# EasyEDA Pro project ProPrj_103-HQU15集成板-Vel3.1.epro, board PCB1
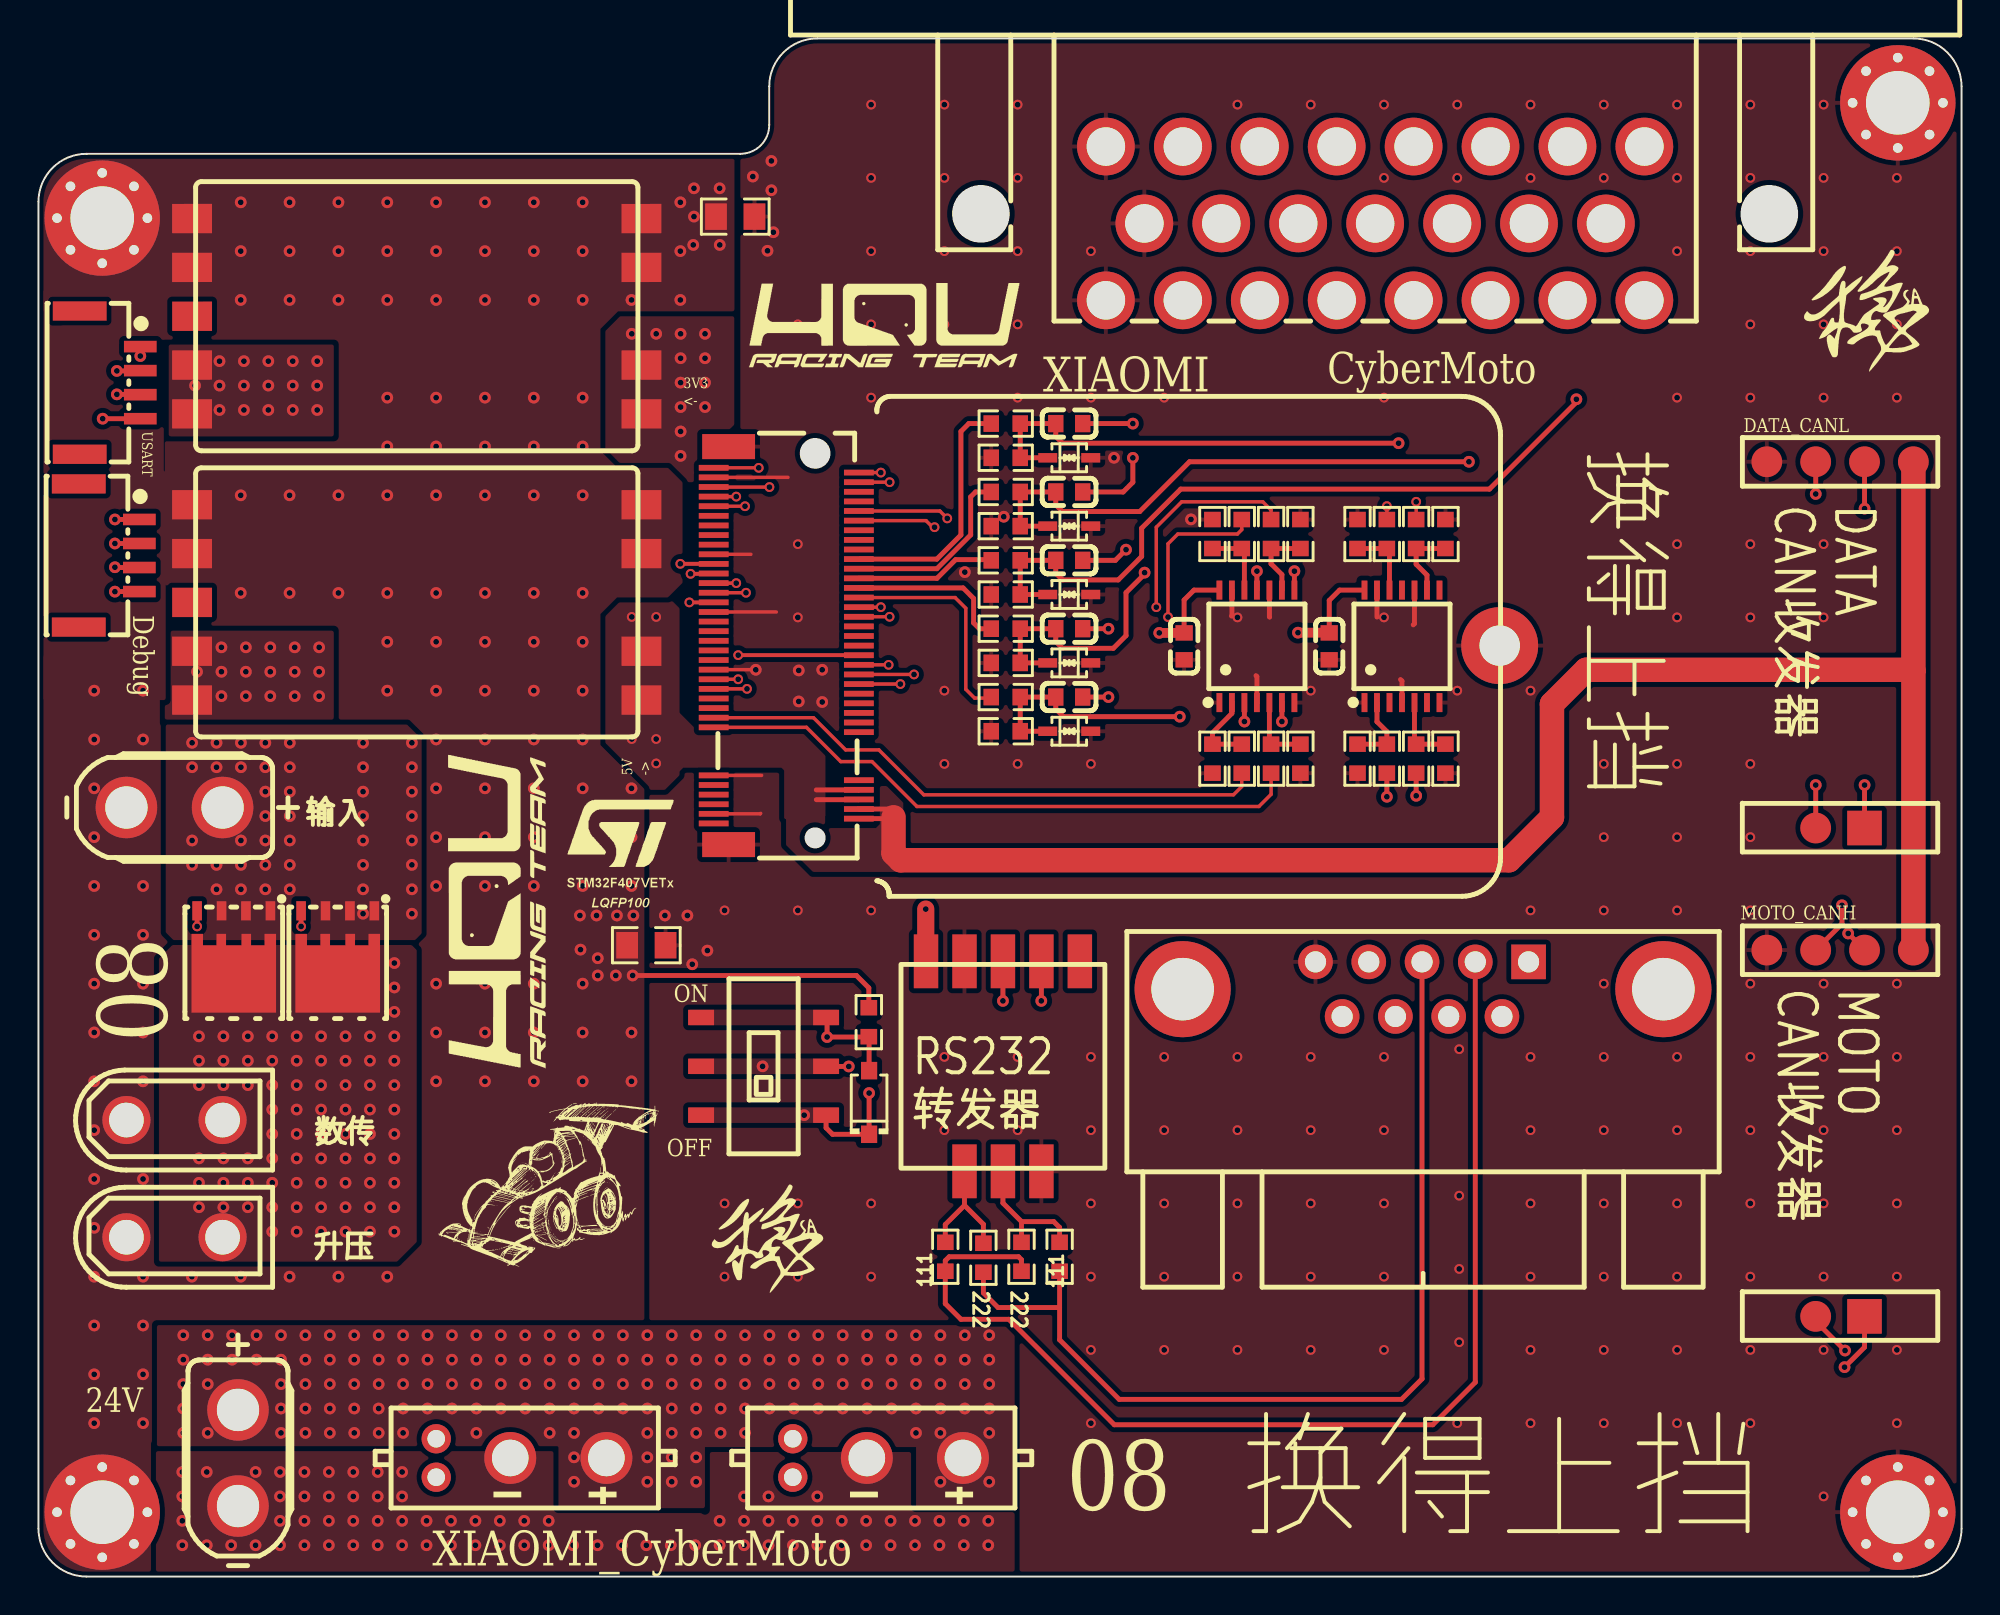
[diagram p5: board, top side]
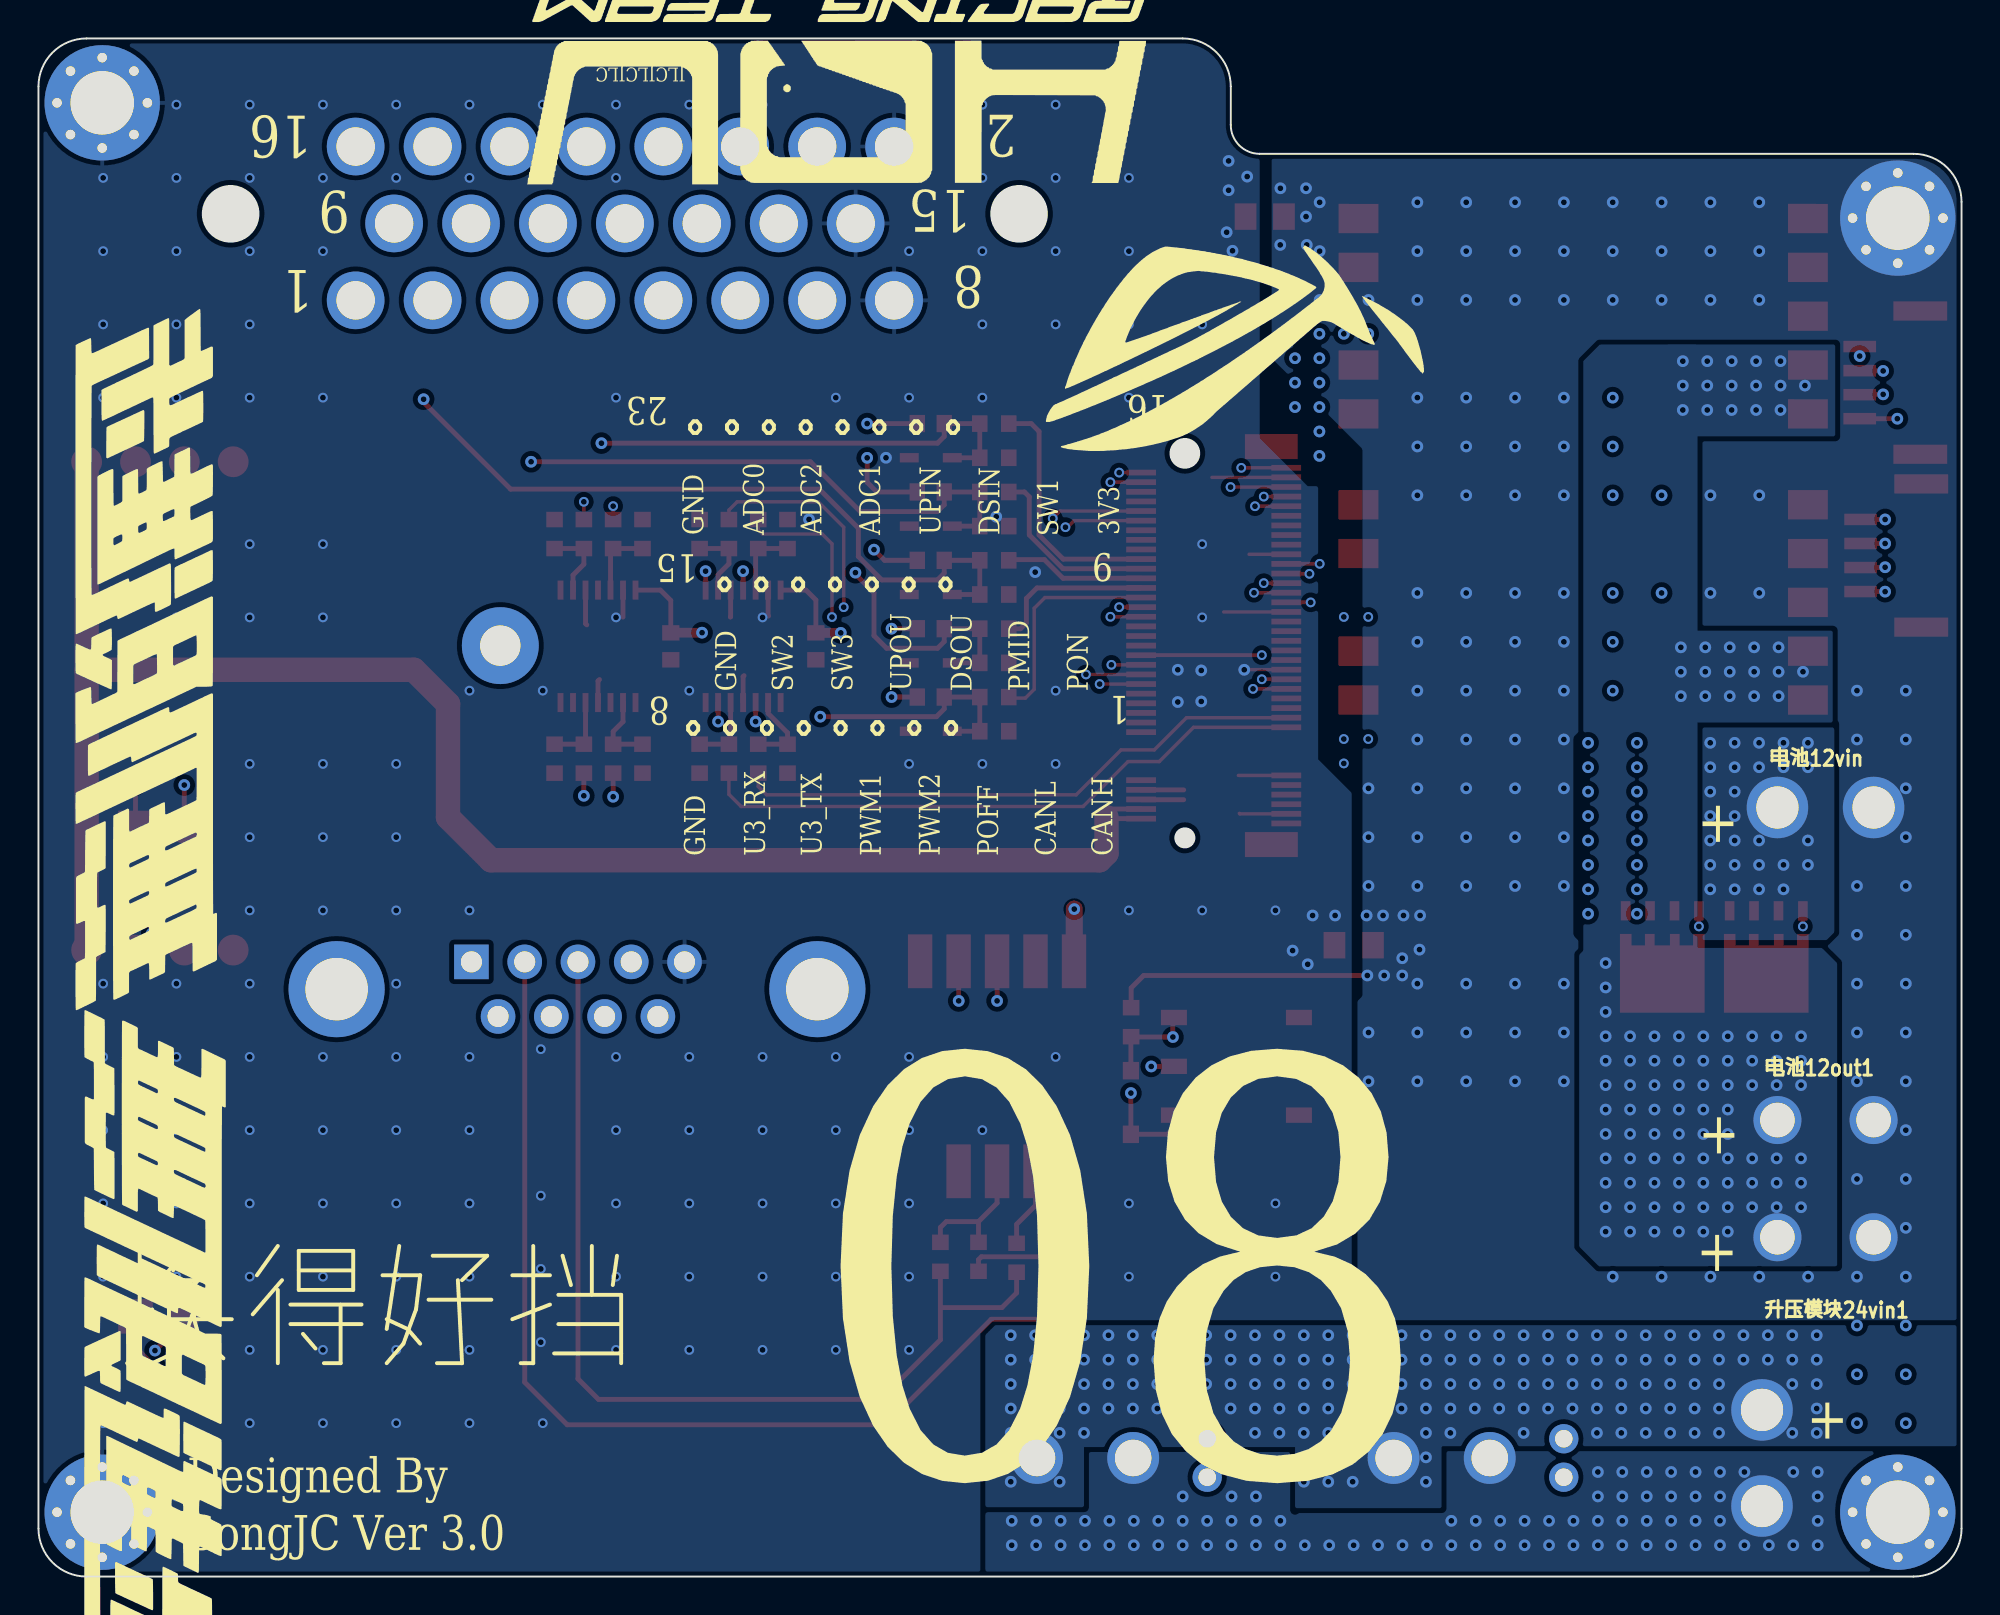
[diagram p6: board, bottom side, seen from below]

Outline 100 x 80 mm; copper layers: Top Layer, Inner1, Inner2, Bottom Layer. Coordinates in mm from the lower left corner of the outline.
Outline path: 0,71.5 arc(0.73,73.27) 2.5,74 36.5,74 arc(37.56,74.44) 38,75.5 38,77.5 arc(38.73,79.27) 40.5,80 97.5,80 arc(99.27,79.27) 100,77.5 100,2.5 arc(99.27,0.73) 97.5,0 2.5,0 arc(0.73,0.73) 0,2.5 0,71.5
Stack: Top Layer 0.035mm 外层铜厚1oz / Dielectric1 0.2104mm 7628 RC49% 8.6mil / Inner1 0.0152mm 内层铜厚 / Dielectric2 1.065mm 1.1mm H/HOZ Copper / Inner2 0.0152mm 内层铜厚 / Dielectric3 0.2104mm 7628 RC49% 8.6mil / Bottom Layer 0.035mm 外层铜厚1oz

## Design rules (mm)
net DATA_CANH: DP2
net DATA_CANL: DP2
net MOTO_CANL: DP1
net MOTO_CANH: DP1
template: 自定义配置
spacing copperThickness1oz (default): track to track 0.102, other pairs 0.152 to 0.3
spacing copperThickness2oz: track to track 0.203, other pairs 0.152 to 0.3
track width copperThickness1oz (default): min 0.127, default 0.254, max 2.54
track width copperThickness2oz: min 0.203, default 0.254, max 2.54
differential pair differentialPair (default): width min 0.127, default 0.254, max 2.54; gap min 0.152, default 0.152
via viaSize (default): diameter min 0.5, default 0.61, max 10; hole min 0.3, default 0.305, max 6.299
net GND_BAT uses ZHILIAN
net VCC_+3V3 uses ZHILIAN
net VCC_+5V uses ZHILIAN
net VCC_BAT uses ZHILIAN
net VCC_+12V uses ZHILIAN
net VCC_+24V uses ZHILIAN
net POWERCTRL_ON uses ZHILIAN
net GND_MOTO uses ZHILIAN
net POWERCTRL_MID uses ZHILIAN

## Placement (name value [footprint] x y rotation side)
12V-24Vout  XT30UPB-M  [CONN-TH_XT30UPB-M]  7.07 23.74 0 top
12Vin  XT30UPB-F30.G.Y  [CONN-TH_XT30UPB-F]  7.07 40 180 top
24Vin  XT30UPB-F30.G.Y  [CONN-TH_XT30UPB-F]  10.38 6.17 270 top
111  0Ω  [R0603]  47.16 16.63 270 top
111#2  -  [R0603]  53.1 16.63 270 top
C158  100nF  [C0603]  53.6 56.41 0 top
C160  100nF  [C0603]  53.6 59.97 0 top
C161  100nF  [C0603]  53.6 52.86 0 top
C162  100nF  [C0603]  53.6 49.3 0 top
C163  100nF  [C0603]  53.6 45.74 0 top
C166  100nF  [C0603]  67.12 48.38 270 top
C167  100nF  [C0603]  59.57 48.38 270 top
CN2  APCI0078-P002A  [NGFF-SMD-BKEY 5+6(2235))]  39.03 48.38 90 top
CN5  776087-1  [CONN-TH_776087-1]  69.51 70.38 180 top
CN16  XT30(2+2)PB-M.G.B  [CONN-TH_XT30PB-M]  43.65 6.17 180 top
CN17  XT30(2+2)PB-M.G.B  [CONN-TH_XT30PB-M]  25.11 6.17 180 top
D2  BZT52C16  [SOD-123_L2.7-W1.7-LS3.8-RD]  43.19 24.66 90 top
D32  PESD3V3L1BA-N  [SOD-323_L1.8-W1.3-LS2.5-BI]  53.6 58.19 180 top
D33  PESD3V3L1BA-N  [SOD-323_L1.8-W1.3-LS2.5-BI]  53.6 54.63 180 top
D34  PESD3V3L1BA-N  [SOD-323_L1.8-W1.3-LS2.5-BI]  53.6 51.08 180 top
D35  PESD3V3L1BA-N  [SOD-323_L1.8-W1.3-LS2.5-BI]  53.6 47.52 180 top
D36  PESD3V3L1BA-N  [SOD-323_L1.8-W1.3-LS2.5-BI]  53.6 43.97 180 top
H2  X6521WVS-2x04H-C60D74  [HDR-SMD_8P-P2.54-V-M-R2-C5-S7.4]  50.15 26.54 270 top
H4  PM254V-11-06-H85  [HDR-TH_6P-P2.54-V-F]  93.69 57.98 180 top
H5  PM254V-11-06-H85  [HDR-TH_6P-P2.54-V-F]  93.69 32.58 180 top
J1  -  [M3螺帽]  96.69 3.35 0 top
J2  -  [M3螺帽]  3.31 3.35 0 top
J3  -  [M3螺帽]  96.69 76.65 0 top
J4  -  [M3螺帽]  3.31 70.66 0 top
LINK1  WAFER-GH1.25-4PWB  [CONN-SMD_4P-P1.25_XUNPU_WAFER-GH1.25-4PWB]  3.67 53.11 270 top
Q11  TPH1R403NL  [POWERVDFN-8_L6.2-W5.2-P1.27-LS6.0-BL]  10.16 32.85 180 top
Q34  TPH1R403NL  [POWERVDFN-8_L6.2-W5.2-P1.27-LS6.0-BL]  15.56 32.85 180 top
R132  10K  [R0603]  43.18 28.83 270 top
R194  1kΩ  [R0603]  50.3 59.97 0 top
R195  4.7kΩ  [R0603]  50.3 58.19 0 top
R196  0Ω  [R0805]  31.61 32.84 0 top
R198  4.7kΩ  [R0603]  50.3 54.63 0 top
R199  1kΩ  [R0603]  50.3 52.86 0 top
R200  4.7kΩ  [R0603]  50.3 51.08 0 top
R211  1kΩ  [R0603]  50.3 49.3 0 top
R212  4.7kΩ  [R0603]  50.3 47.52 0 top
R213  0Ω  [R0805]  36.23 70.73 0 top
R216  1kΩ  [R0603]  50.3 45.74 0 top
R217  4.7kΩ  [R0603]  50.3 43.97 0 top
R222  10kΩ  [R0603]  73.16 42.54 90 top
R223  10kΩ  [R0603]  68.59 42.54 90 top
R224  10kΩ  [R0603]  73.16 54.22 270 top
R225  10kΩ  [R0603]  68.59 54.22 270 top
R226  100R  [R0603]  70.12 54.22 90 top
R227  100R  [R0603]  71.64 54.22 90 top
R228  100R  [R0603]  70.12 42.54 270 top
R229  100R  [R0603]  71.64 42.54 270 top
R230  10kΩ  [R0603]  65.62 42.54 90 top
R231  10kΩ  [R0603]  61.05 42.54 90 top
R232  10kΩ  [R0603]  65.62 54.22 270 top
R233  10kΩ  [R0603]  61.05 54.22 270 top
R234  100R  [R0603]  62.57 54.22 90 top
R235  100R  [R0603]  64.1 54.22 90 top
R236  100R  [R0603]  62.57 42.54 270 top
R237  100R  [R0603]  64.1 42.54 270 top
R238  1kΩ  [R0603]  50.3 56.41 0 top
R240  0Ω  [R0603]  51.12 16.63 270 top
R241  0Ω  [R0603]  49.14 16.58 270 top
SW1  SS-3235S-L3  [SW-SMD_SS-3235S-L3.00]  37.71 26.54 270 top
U5V1  -  [逐飞电源]  19.67 65.55 90 top
U5V2  -  [逐飞电源]  19.67 50.67 90 top
U54  DR-9F  [DR9-TH_ZHOUR_DR-9P-L]  72 30.55 0 top
U55  SN74HC125PWR  [TSSOP-14_L5.0-W4.4-P0.65-LS6.5-BL]  70.9 48.38 0 top
U56  SN74HC125PWR  [TSSOP-14_L5.0-W4.4-P0.65-LS6.5-BL]  63.36 48.38 0 top
USART1  WAFER-GH1.25-4PWB  [CONN-SMD_4P-P1.25_XUNPU_WAFER-GH1.25-4PWB]  3.72 62.1 270 top
无线数传电源  XT30UPB-M  [CONN-TH_XT30UPB-M]  7.07 17.65 0 top

## Footprints (pads in the part's own frame, mm; a bottom-side part is the same pattern mirrored in y, then rotated)
C0603
  rect 0.8x0.9 smd: 1(-0.7,0) 2(0.7,0)
CONN-SMD_4P-P1.25_XUNPU_WAFER-GH1.25-4PWB
  rect 0.6x1.7 smd: 1(-1.875,1.575) 2(-0.625,1.575) 3(0.625,1.575) 4(1.875,1.575)
  rect 1x2.8 smd: 5(3.725,-1.575) 6(-3.725,-1.575)
CONN-TH_776087-1
  round 3 hole 2: 1(-14,4) 2(-10,4) 3(-6,4) 4(-2,4) 5(2,4) 6(6,4) 7(10,4) 8(14,4) 9(-12,0) 10(-8,0) 11(-4,0) 12(0,0) 13(4,0) 14(8,0) 15(12,0) 16(-14,-4) 17(-10,-4) 18(-6,-4) 19(-2,-4) 20(2,-4) 21(6,-4) 22(10,-4) 23(14,-4)
CONN-TH_XT30PB-M
  round 1.524 hole 0.914: 1(4.425,1) 2(4.425,-1)
  round 2.7 hole 1.9: 3(0.575,0) 4(-4.425,0)
CONN-TH_XT30UPB-F
  round 3.2 hole 2.2: 1(-2.5,0) 2(2.5,0)
CONN-TH_XT30UPB-M
  round 2.5 hole 1.8: 1(-2.5,0) 2(2.5,0)
DR9-TH_ZHOUR_DR-9P-L
  rect 1.8x1.8 hole 1.1: 1(5.489,1.42)
  round 1.8 hole 1.1: 2(2.719,1.42) 3(-0.051,1.42) 4(-2.821,1.42) 5(-5.59,1.42) 6(4.104,-1.42) 7(1.335,-1.42) 8(-1.435,-1.42) 9(-4.205,-1.42)
  round 5 hole 3.25: 10(-12.5,0) 11(12.5,0)
HDR-SMD_8P-P2.54-V-M-R2-C5-S7.4
  rect 2.8x1.27 smd: 1(5.461,-2) 2(5.461,0) 3(5.461,2) 4(-5.461,4) 5(-5.461,2) 6(-5.461,0) 7(-5.461,-2) 8(-5.461,-4)
HDR-TH_6P-P2.54-V-F
  rect 1.8x1.8 smd: 1(-1.267,19.05)
  round 1.6 smd: 2(1.273,19.05) 3(-3.807,0) 4(-1.267,0) 5(1.273,0) 6(3.813,0)
M3螺帽
  round 6 hole 3.302: 1(0,0)
  round 1 hole 0.5: 2(0,2.349) 3(0,-2.349) 4(2.349,0) 5(-2.349,0) 6(1.651,1.651) 7(-1.651,-1.651) 8(1.651,-1.651) 9(-1.651,1.651)
NGFF-SMD-BKEY 5+6(2235))
  rect 0.3x1.55 smd: 1(-9.212,3.914) 2(-8.962,-3.635) 3(-8.712,3.914) 4(-8.462,-3.635) 5(-8.212,3.914) 6(-7.962,-3.635) 7(-7.712,3.914) 8(-7.462,-3.635) 9(-7.212,3.914) 10(-6.962,-3.635) 11(-6.712,3.914) 20(-4.462,-3.635) 21(-4.212,3.914) 22(-3.962,-3.635) 23(-3.712,3.914) 24(-3.462,-3.635) 25(-3.212,3.914) 26(-2.962,-3.635) 27(-2.712,3.914) 28(-2.462,-3.635) 29(-2.212,3.914) 30(-1.962,-3.635) 31(-1.712,3.914) 32(-1.462,-3.635) 33(-1.212,3.914) 34(-0.962,-3.635) 35(-0.712,3.914) 36(-0.462,-3.635) 37(-0.212,3.914) 38(0.038,-3.635) 39(0.288,3.914) 40(0.538,-3.635) 41(0.788,3.914) 42(1.038,-3.635) 43(1.288,3.914) 44(1.538,-3.635) 45(1.788,3.914) 46(2.038,-3.635) 47(2.288,3.914) 48(2.538,-3.635) 49(2.788,3.914) 50(3.038,-3.635) 51(3.288,3.914) 52(3.538,-3.635) 53(3.788,3.914) 54(4.038,-3.635) 55(4.288,3.914) 56(4.538,-3.635) 57(4.788,3.914) 58(5.038,-3.635) 59(5.288,3.914) 60(5.538,-3.635) 61(5.788,3.914) 62(6.038,-3.635) 63(6.288,3.914) 64(6.538,-3.635) 65(6.788,3.914) 66(7.038,-3.635) 67(7.288,3.914) 68(7.538,-3.635) 69(7.788,3.914) 70(8.038,-3.635) 71(8.288,3.914) 72(8.538,-3.635) 73(8.788,3.914) 74(9.038,-3.635) 75(9.288,3.914)
  round 4 hole 2.1: 12(0.038,-36.957)
  rect 1.3x2.75 smd: 76(-10.312,3.139) 77(10.388,3.139)
POWERVDFN-8_L6.2-W5.2-P1.27-LS6.0-BL
  rect 0.5x1 smd: 1(-1.905,-1.775) 2(-0.635,-1.775) 3(0.635,-1.775) 4(1.905,-1.775)
  custom 4.4x4.1 smd: 5(0,1.775)
R0603
  rect 0.806x0.864 smd: 1(-0.753,0) 2(0.753,0)
R0805
  rect 1.133x1.377 smd: 1(-1,0) 2(1,0)
SOD-123_L2.7-W1.7-LS3.8-RD
  rect 0.91x0.84 smd: 1(-1.655,0) 2(1.655,0)
SOD-323_L1.8-W1.3-LS2.5-BI
  rect 0.985x0.49 smd: 1(-1.117,0) 2(1.117,0)
SW-SMD_SS-3235S-L3.00
  rect 0.8x1.35 smd: 1(-2.54,3.25) 2(0,3.25) 3(2.54,3.25) 4(-2.54,-3.25) 5(0,-3.25) 6(2.54,-3.25)
TSSOP-14_L5.0-W4.4-P0.65-LS6.5-BL
  rect 0.305x0.991 smd: 1(-1.95,-2.925) 2(-1.3,-2.925) 3(-0.65,-2.925) 4(0,-2.925) 5(0.65,-2.925) 6(1.3,-2.925) 7(1.95,-2.925) 8(1.95,2.925) 9(1.3,2.925) 10(0.65,2.925) 11(0,2.925) 12(-0.65,2.925) 13(-1.3,2.925) 14(-1.95,2.925)
逐飞电源
  custom 1.524x2.073 smd: 1(5.08,11.684)
  custom 1.525x2.073 smd: 2(2.54,11.684) 3(0,11.684) 4(-2.54,11.684) 5(-5.08,11.684) 6(-5.08,-11.684) 7(-2.54,-11.684) 8(2.54,-11.684) 9(5.08,-11.684)

## Nets
As in the schematic, except:
GND_BAT: 12V-24Vout.1 12Vin.2 J2.1 J2.2 J2.3 J2.4 J2.5 J2.6 J2.7 J2.8 J2.9 J4.1 J4.2 J4.3 J4.4 J4.5 J4.6 J4.7 J4.8 J4.9 R132.1 R196.1 R213.1 U5V1.1 U5V1.2 U5V1.8 U5V1.9 U5V2.1 U5V2.2 U5V2.8 U5V2.9 无线数传电源.1
GND_PRO: C166.2 C167.2 CN2.3 CN2.11 CN2.12 CN2.33 CN2.45 CN2.57 CN2.73 CN2.76 CN2.77 CN5.8 CN5.15 CN5.23 D32.1 D33.1 D34.1 D35.1 D36.1 H2.3 H2.7 H4.6 H5.6 J1.1 J1.2 J1.3 J1.4 J1.5 J1.6 J1.7 J1.8 J1.9 J3.1 J3.2 J3.3 J3.4 J3.5 J3.6 J3.7 J3.8 J3.9 LINK1.1 R195.1 R196.2 R198.1 R200.1 R212.1 R213.2 R217.1 R222.1 R223.1 R224.1 R225.1 R230.1 R231.1 R232.1 R233.1 U54.5 U55.1 U55.4 U55.7 U55.10 U55.13 U56.1 U56.4 U56.7 U56.10 U56.13 USART1.1
232R: 111#2.1 H2.2 R240.1
$5N12885: 111#2.2 R241.2 U54.3
$5N12893: 111.2 R240.2 U54.2

Pads without a net: H2 4; LINK1 5 6; U5V1 3; U5V2 3; U54 1 4 6 7 8 9 10 11; USART1 5 6

## Via types
v1: diameter 0.61, hole 0.305, Top Layer to Bottom Layer, 604 vias
v2: diameter 0.508, hole 0.305, Top Layer to Bottom Layer, 190 vias

## Routing (per net, layer and track width the routed paths; a pad name or vN(x,y) marks a point on that pad's centre or on a via; arc(x,y) is an arc through that point)
GND_BAT: length 13.6
  Top Layer w0.254: R132.1 43.18,30.62 42.53,31.26 v1(30.9,31.26)
  vias: v1(2.9,46.08) v1(2.9,43.54) v1(2.9,41) v1(2.9,38.46) v1(2.9,35.92) v1(2.9,33.38) v1(2.9,30.84) v1(2.9,28.3) v1(2.9,25.76) v1(2.9,23.22) v1(2.9,20.68) v1(2.9,18.14) v1(2.9,15.6) v1(2.9,13.06) v1(2.9,10.52) v1(2.9,7.98) v1(5.44,46.08) v1(5.44,43.54) v1(5.44,35.92) v1(5.44,33.38) v1(5.44,30.84) v1(5.44,28.3) v1(5.44,25.76) v1(5.44,20.68) v1(5.44,15.6) v1(5.44,13.06) v1(5.44,10.52) v1(5.44,7.98) v1(7.98,15.6) v1(10.52,71.48) v1(10.52,68.94) v1(10.52,66.4) v1(10.52,56.24) v1(10.52,51.16) v1(10.52,15.6) v1(13.06,71.48) v1(13.06,68.94) v1(13.06,66.4) v1(13.06,56.24) v1(13.06,51.16) v1(13.06,15.6) v1(15.6,71.48) v1(15.6,68.94) v1(15.6,66.4) v1(15.6,56.24) v1(15.6,51.16) v1(15.6,15.6) v1(18.14,71.48) v1(18.14,68.94) v1(18.14,66.4) v1(18.14,61.32) v1(18.14,58.78) v1(18.14,56.24) v1(18.14,51.16) v1(18.14,48.62) v1(18.14,46.08) v1(18.14,15.6) v1(20.68,71.48) v1(20.68,68.94) v1(20.68,66.4) v1(20.68,61.32) v1(20.68,58.78) v1(20.68,56.24) v1(20.68,51.16) v1(20.68,48.62) v1(20.68,46.08) v1(20.68,43.54) v1(20.68,41) v1(20.68,38.46) v1(20.68,35.92) v1(20.68,30.84) v1(20.68,28.3) v1(20.68,25.76) v1(23.22,71.48) v1(23.22,68.94) v1(23.22,66.4) v1(23.22,61.32) v1(23.22,58.78) v1(23.22,56.24) v1(23.22,51.16) v1(23.22,48.62) v1(23.22,46.08) v1(23.22,43.54) v1(23.22,41) v1(23.22,38.46) v1(23.22,35.92) v1(23.22,30.84) v1(23.22,28.3) v1(23.22,25.76) v1(25.76,71.48) v1(25.76,68.94) v1(25.76,66.4) v1(25.76,61.32) v1(25.76,58.78) v1(25.76,56.24) v1(25.76,51.16) v1(25.76,48.62) v1(25.76,46.08) v1(25.76,43.54) v1(25.76,41) v1(25.76,38.46) v1(25.76,35.92) v1(25.76,30.84) v1(25.76,28.3) v1(25.76,25.76) v1(28.16,34.38) v1(28.19,32.61) v1(28.3,71.48) v1(28.3,68.94) v1(28.3,66.4) v1(28.3,61.32) v1(28.3,58.78) v1(28.3,56.24) v1(28.3,51.16) v1(28.3,48.62) v1(28.3,46.08) v1(28.3,43.54) v1(28.3,41) v1(28.3,38.46) v1(28.3,35.92) v1(28.3,30.84) v1(28.3,28.3) v1(28.3,25.76) v1(29.02,34.38) v1(29.08,32.16) v1(29.08,31.26) v1(30.02,31.26) v1(30.08,34.38) v1(30.84,66.4) v1(30.84,41) v1(30.84,38.46) v1(30.84,35.92) v1(30.84,28.3) v1(30.84,25.76) v1(30.94,34.38) v1(33.38,71.48) v1(33.38,68.94) v1(33.38,66.4) v1(34.05,69.26) v1(34.09,72.21) v1(34.09,70.74) v1(35.42,72.21) v1(35.43,69.26)
GND_MOTO:
  vias: v1(7.48,5.44) v1(7.48,4.17) v1(7.48,2.9) v1(7.48,1.63) v1(8.75,5.44) v1(8.75,1.63) v1(10.02,1.63) v1(11.29,5.44) v1(11.29,1.63) v1(12.56,5.44) v1(12.56,4.17) v1(12.56,2.9) v1(12.56,1.63) v1(13.83,5.44) v1(13.83,4.17) v1(13.83,2.9) v1(13.83,1.63) v1(15.1,5.44) v1(15.1,4.17) v1(15.1,2.9) v1(15.1,1.63) v1(16.37,5.44) v1(16.37,4.17) v1(16.37,2.9) v1(16.37,1.63) v1(17.64,5.44) v1(17.64,4.17) v1(17.64,2.9) v1(17.64,1.63) v1(18.91,5.44) v1(18.91,4.17) v1(18.91,2.9) v1(18.91,1.63) v1(20.18,2.9) v1(20.18,1.63) v1(21.45,2.9) v1(21.45,1.63) v1(22.72,2.9) v1(22.72,1.63) v1(23.99,2.9) v1(23.99,1.63) v1(25.26,2.9) v1(25.26,1.63) v1(26.53,2.9) v1(26.53,1.63) v1(27.8,1.63) v1(29.07,1.63) v1(30.34,1.63) v1(31.61,1.63) v1(32.88,1.63) v1(34.15,1.63) v1(35.42,2.9) v1(35.42,1.63) v1(36.69,4.17) v1(36.69,2.9) v1(36.69,1.63) v1(37.96,4.17) v1(37.96,2.9) v1(37.96,1.63) v1(39.23,2.9) v1(39.23,1.63) v1(40.5,4.17) v1(40.5,2.9) v1(40.5,1.63) v1(41.77,2.9) v1(41.77,1.63) v1(43.04,2.9) v1(43.04,1.63) v1(44.31,2.9) v1(44.31,1.63) v1(45.58,2.9) v1(45.58,1.63) v1(46.85,2.9) v1(46.85,1.63) v1(48.12,2.9) v1(48.12,1.63) v1(49.39,2.9) v1(49.39,1.63)
GND_PRO: length 76.4
  Top Layer w0.178: 37.55,39.69 37.53,39.67 CN2.3 ; CN2.45 38.37,50.17 ; CN2.11 37.6,41.67 ; CN2.73 38.98,57.17 ; CN2.33 37.29,47.17 v1(37.3,47.16) ; CN2.57 37.05,53.17
  Top Layer w0.254: U56.13 62.06,49.98 62.04,49.96 ; U55.13 69.6,49.91 ; 63.31,46.86 63.36,46.81 63.36,45.46 ; U55.10 71.55,49.56 71.49,49.5 ; 70.9,45.46 70.9,46.58 70.83,46.66 ; U56.10 64.01,49.92 64.02,49.91 ; v1(3.98,54.98) LINK1.1 ; v1(5.3,63.48) USART1.1
  Inner1 w0.254: v1(37.15,72.82) 36.39,73.57 7.83,73.57 7.38,73.12 7.38,69.01 5.3,66.92 v1(5.3,63.48) 5.3,56.3 v1(3.98,54.98)
  vias: v1(32.58,34.38) v1(33.74,34.38) v1(34,31.85) v1(34.78,32.56) v1(37.91,68.96) v1(38.11,73.63) v1(38.11,72.11) v1(38.21,69.92) v1(39.53,47.13) v1(39.53,45.52) v1(40.75,47.16) v1(40.75,45.49) v1(48.17,52.24) v1(50.2,55.12) v1(55.93,58.19) v1(59.93,54.99) v2(35.68,34.65) v2(35.68,19.41) v2(35.68,15.6) v2(39.49,65.13) v2(39.49,53.7) v2(39.49,49.89) v2(39.49,34.65) v2(39.49,19.41) v2(39.49,15.6) v2(43.3,76.56) v2(43.3,72.75) v2(43.3,68.94) v2(43.3,65.13) v2(43.3,61.32) v2(43.3,34.65) v2(43.3,19.41) v2(43.3,15.6) v2(47.11,76.56) v2(47.11,72.75) v2(47.11,68.94) v2(47.11,65.13) v2(47.11,46.08) v2(47.11,42.27) v2(47.11,27.03) v2(47.11,23.22) v2(50.92,76.56) v2(50.92,72.75) v2(50.92,68.94) v2(50.92,65.13) v2(50.92,61.32) v2(50.92,42.27) v2(50.92,27.03) v2(50.92,23.22) v2(54.73,68.94) v2(54.73,61.32) v2(54.73,42.27) v2(54.73,27.03) v2(54.73,23.22) v2(54.73,19.41) v2(54.73,15.6) v2(54.73,11.79) v2(54.73,7.98) v2(58.54,61.32) v2(58.54,27.03) v2(58.54,23.22) v2(58.54,19.41) v2(58.54,15.6) v2(58.54,11.79) v2(62.35,76.56) v2(62.35,49.89) v2(62.35,27.03) v2(62.35,23.22) v2(62.35,19.41) v2(62.35,15.6) v2(62.35,11.79) v2(66.16,76.56) v2(66.16,46.08) v2(66.16,27.03) v2(66.16,23.22) v2(66.16,19.41) v2(66.16,15.6) v2(66.16,11.79) v2(69.97,76.56) v2(69.97,72.75) v2(69.97,61.32) v2(69.97,49.89) v2(69.97,27.03) v2(69.97,23.22) v2(69.97,19.41) v2(69.97,15.6) v2(69.97,11.79) v2(73.78,76.56) v2(73.78,72.75) v2(73.78,46.08) v2(73.78,7.98) v2(73.88,27.43) v2(73.88,19.81) v2(73.88,16) v2(73.88,12.19) v2(77.59,76.56) v2(77.59,72.75) v2(77.59,46.08) v2(77.59,34.65) v2(77.59,27.03) v2(77.59,23.22) v2(77.59,19.41) v2(77.59,15.6) v2(77.59,11.79) v2(77.59,7.98) v2(81.4,76.56) v2(81.4,72.75) v2(81.4,42.27) v2(81.4,38.46) v2(81.4,34.65) v2(81.4,30.84) v2(81.4,27.03) v2(81.4,23.22) v2(81.4,19.41) v2(81.4,15.6) v2(81.4,11.79) v2(81.4,7.98) v2(85.21,76.56) v2(85.21,72.75) v2(85.21,68.94) v2(85.21,61.32) v2(85.21,53.7) v2(85.21,49.89) v2(85.21,42.27) v2(85.21,38.46) v2(85.21,34.65) v2(85.21,27.03) v2(85.21,23.22) v2(85.21,19.41) v2(85.21,15.6) v2(85.21,11.79) v2(85.21,7.98) v2(89.02,76.56) v2(89.02,72.75) v2(89.02,68.94) v2(89.02,65.13) v2(89.02,61.32) v2(89.02,53.7) v2(89.02,49.89) v2(89.02,42.27) v2(89.02,38.46) v2(89.02,34.65) v2(89.02,30.84) v2(89.02,27.03) v2(89.02,23.22) v2(89.02,19.41) v2(89.02,15.6) v2(89.02,11.79) v2(89.02,7.98) v2(92.83,76.56) v2(92.83,72.75) v2(92.83,68.94) v2(92.83,65.13) v2(92.83,61.32) v2(92.83,53.7) v2(92.83,49.89) v2(92.83,30.84) v2(92.83,27.03) v2(92.83,23.22) v2(92.83,19.41) v2(92.83,15.6) v2(92.83,11.79) v2(92.83,4.17) v2(96.64,72.75) v2(96.64,68.94) v2(96.64,65.13) v2(96.64,61.32) v2(96.64,30.84) v2(96.64,27.03) v2(96.64,23.22) v2(96.64,19.41) v2(96.64,15.6) v2(96.64,11.79) v2(96.64,7.98)
VCC_+3V3: length 264.9
  Top Layer w0.254: C162.2 v1(55.64,49.3) ; C158.2 56.4,56.41 56.91,56.92 v1(56.91,58.19) ; v1(56.55,53.41) 56,52.86 C161.2 ; C167.1 59.57,50.79 60.09,51.31 61.41,51.31 ; v1(3.97,51.23) 3.98,51.23 LINK1.4 ; C163.2 v1(55.64,45.74) ; 67.12,49.08 67.12,50.77 67.66,51.31 U55.14 ; C160.2 v1(56.91,59.97) ; USART1.4 v1(3.34,60.22)
  Top Layer w0.508: C166.1 67.11,49.09 v1(65.49,49.09) ; v1(58.28,49.08) C167.1
  Top Layer w0.889: v1(46.14,34.72) 46.14,32.01 H2.8
  Inner2 w0.254: v1(30.85,64.64) 30.44,64.23 4.23,64.23 3.34,63.34 v1(3.34,60.22) 3.31,60.2 3.31,51.89 v1(3.97,51.23)
  Inner2 w0.381: v1(58.28,49.08) 58.28,41.17 58.34,41.12 ; v1(65.49,49.09) 62.19,49.09 61.07,47.98 61.07,41.14 61.05,41.12 ; 55.59,41.12 55.64,41.16 v1(55.64,45.74) v1(55.64,49.3) 55.64,52.5 v1(56.55,53.41) 56.91,53.77 v1(56.91,58.19) v1(56.91,59.97)
  Inner2 w0.889: v1(46.14,34.72) 74.46,34.72 75.15,35.41 75.15,41.07 73.77,42.44 69.15,42.44 67.83,41.12 55.59,41.12
  Inner2 w1.016: v1(34.66,60.83) 40.75,60.83 41.87,59.71 41.87,43.76 44.51,41.12 55.59,41.12 ; v1(34.66,64.64) 37.6,64.64 39.23,66.26 39.23,76.27 40.86,77.9 82.36,77.9 83.51,76.75 CN5.16
  vias: v1(32.12,64.64) v1(33.39,64.64) v1(33.39,63.37) v1(33.39,62.1) v1(33.39,60.83) v1(33.39,59.56) v1(33.39,58.29) v1(34.66,63.37) v1(34.66,62.1)
VCC_+5V: length 95.9
  Top Layer w0.254: CN2.4 44.31,39.92 ; 44.46,39.49 44.39,39.42 CN2.2 ; 40.45,40.41 42.65,40.41 CN2.6 ; CN2.8 42.66,40.91 40.45,40.91
  Top Layer w1.27: 97.5,47.11 97.45,47.16 80.48,47.16 78.7,45.39 78.7,39.49 76.47,37.26 44.83,37.26 44.46,37.62 44.46,39.49 ; 97.5,47.11 97.5,32.58 ; 97.5,47.11 97.5,57.98
  vias: v2(30.85,49.91) v2(30.85,43.56) v2(32.12,49.91) v2(32.12,43.56) v2(32.12,42.29)
VCC_+12V: length 115.8
  Top Layer w0.254: v1(43.19,25.15) D2.1 41.29,23 40.96,23.34 SW1.3
  Inner2 w0.254: v1(43.19,25.15) 43.81,24.53 77.98,24.53 79.31,25.87 79.31,48.99 76.93,51.37 76.93,64.95 CN5.3 ; v1(39.82,24) 39.82,32.81 38.83,33.8 17.47,33.8
  vias: v1(7.99,43.36) v1(7.99,42.09) v1(7.99,38.28) v1(7.99,37.02) v1(9.26,43.36) v1(9.26,42.09) v1(9.26,37.02) v1(9.26,35.75) v1(10.53,43.36) v1(10.53,42.09) v1(10.53,38.28) v1(10.53,37.02) v1(10.53,35.75) v1(11.8,43.36) v1(11.8,42.09) v1(11.8,40.83) v1(11.8,39.56) v1(11.8,38.28) v1(11.8,37.02) v1(11.8,35.75) v1(13.07,43.36) v1(13.07,42.09) v1(13.07,40.83) v1(13.07,39.56) v1(13.07,38.28) v1(13.07,37.02) v1(13.07,35.75) v1(16.88,43.36) v1(16.88,42.09) v1(16.88,40.83) v1(16.88,39.56) v1(16.88,38.28) v1(16.88,37.02) v1(16.88,35.75) v1(16.88,34.47) v1(19.42,43.36) v1(19.42,42.09) v1(19.42,40.83) v1(19.42,39.56) v1(19.42,38.28) v1(19.42,37.02) v1(19.42,35.75) v1(19.42,34.47)
VCC_+24V:
  vias: v1(7.53,12.55) v1(7.53,11.28) v1(7.53,10.01) v1(7.53,8.74) v1(7.53,7.47) v1(8.8,12.55) v1(8.8,11.28) v1(8.8,10.01) v1(8.8,7.47) v1(10.07,12.55) v1(10.07,11.28) v1(11.34,12.55) v1(11.34,11.28) v1(12.61,12.55) v1(12.61,11.28) v1(12.61,10.01) v1(12.61,8.74) v1(12.61,7.47) v1(13.88,12.55) v1(13.88,11.28) v1(13.88,10.01) v1(13.88,8.74) v1(13.88,7.47) v1(15.15,12.55) v1(15.15,11.28) v1(15.15,10.01) v1(15.15,8.74) v1(15.15,7.47) v1(16.42,12.55) v1(16.42,11.28) v1(16.42,10.01) v1(16.42,8.74) v1(16.42,7.47) v1(17.69,12.55) v1(17.69,11.28) v1(17.69,10.01) v1(17.69,8.74) v1(17.69,7.47) v1(18.96,12.55) v1(18.96,11.28) v1(18.96,10.01) v1(18.96,8.74) v1(18.96,7.47) v1(20.23,12.55) v1(20.23,11.28) v1(20.23,10.01) v1(20.23,8.74) v1(21.5,12.55) v1(21.5,11.28) v1(21.5,10.01) v1(21.5,8.74) v1(22.77,12.55) v1(22.77,11.28) v1(22.77,10.01) v1(22.77,8.74) v1(22.77,7.47) v1(24.04,12.55) v1(24.04,11.28) v1(24.04,10.01) v1(24.04,8.74) v1(25.31,12.55) v1(25.31,11.28) v1(25.31,10.01) v1(25.31,8.74) v1(26.58,12.55) v1(26.58,11.28) v1(26.58,10.01) v1(26.58,8.74) v1(26.58,7.47) v1(27.85,12.55) v1(27.85,11.28) v1(27.85,10.01) v1(27.85,8.74) v1(27.85,7.47) v1(27.85,6.2) v1(27.85,4.93) v1(29.12,12.55) v1(29.12,11.28) v1(29.12,10.01) v1(29.12,8.74) v1(30.39,12.55) v1(30.39,11.28) v1(30.39,10.01) v1(30.39,8.74) v1(31.66,12.55) v1(31.66,11.28) v1(31.66,10.01) v1(31.66,8.74) v1(31.66,7.47) v1(31.66,6.2) v1(31.66,4.93) v1(32.93,12.55) v1(32.93,11.28) v1(32.93,10.01) v1(32.93,8.74) v1(32.93,7.47) v1(32.93,6.2) v1(32.93,4.93) v1(34.2,12.55) v1(34.2,11.28) v1(34.2,10.01) v1(34.2,8.74) v1(34.2,7.47) v1(34.2,6.2) v1(34.2,4.93) v1(35.47,12.55) v1(35.47,11.28) v1(35.47,10.01) v1(35.47,8.74) v1(35.47,7.47) v1(36.74,12.55) v1(36.74,11.28) v1(36.74,10.01) v1(36.74,8.74) v1(36.74,7.47) v1(38.01,12.55) v1(38.01,11.28) v1(38.01,10.01) v1(38.01,8.74) v1(39.28,12.55) v1(39.28,11.28) v1(39.28,10.01) v1(39.28,8.74) v1(40.55,12.55) v1(40.55,11.28) v1(40.55,10.01) v1(40.55,8.74) v1(41.82,12.55) v1(41.82,11.28) v1(41.82,10.01) v1(41.82,8.74) v1(43.09,12.55) v1(43.09,11.28) v1(43.09,10.01) v1(43.09,8.74) v1(44.36,12.55) v1(44.36,11.28) v1(44.36,10.01) v1(44.36,8.74) v1(45.63,12.55) v1(45.63,11.28) v1(45.63,10.01) v1(45.63,8.74) v1(45.63,7.47) v1(46.9,12.55) v1(46.9,11.28) v1(46.9,10.01) v1(46.9,8.74) v1(46.9,7.47) v1(46.9,4.93) v1(48.17,12.55) v1(48.17,11.28) v1(48.17,10.01) v1(48.17,8.74) v1(49.44,12.55) v1(49.44,11.28) v1(49.44,10.01) v1(49.44,8.74) v1(49.44,7.47) v1(49.44,4.93)
VCC_BAT:
  vias: v1(8.14,61.95) v1(8.25,47.06) v1(8.35,28.1) v1(8.35,26.83) v1(8.35,25.56) v1(8.35,21.75) v1(8.35,20.48) v1(8.35,19.21) v1(9.41,63.22) v1(9.41,61.95) v1(9.41,60.68) v1(9.52,48.33) v1(9.52,47.06) v1(9.52,45.79) v1(9.62,28.1) v1(9.62,26.83) v1(9.62,25.56) v1(9.62,21.75) v1(9.62,20.48) v1(9.62,19.21) v1(10.68,63.22) v1(10.68,61.95) v1(10.68,60.68) v1(10.78,48.33) v1(10.78,47.06) v1(10.78,45.79) v1(10.89,28.1) v1(10.89,26.83) v1(10.89,25.56) v1(10.89,21.75) v1(10.89,20.48) v1(10.89,19.21) v1(11.95,63.22) v1(11.95,61.95) v1(11.95,60.68) v1(12.06,48.33) v1(12.06,47.06) v1(12.06,45.79) v1(12.16,28.1) v1(12.16,26.83) v1(12.16,25.56) v1(12.16,24.29) v1(12.16,23.02) v1(12.16,21.75) v1(12.16,20.48) v1(12.16,19.21) v1(12.16,17.94) v1(13.22,63.22) v1(13.22,61.95) v1(13.22,60.68) v1(13.33,48.33) v1(13.33,47.06) v1(13.33,45.79) v1(13.43,28.1) v1(13.43,26.83) v1(13.43,25.56) v1(13.43,24.29) v1(13.43,23.02) v1(13.43,21.75) v1(13.43,20.48) v1(13.43,19.21) v1(13.43,17.94) v1(14.49,63.22) v1(14.49,61.95) v1(14.49,60.68) v1(14.59,48.33) v1(14.59,47.06) v1(14.59,45.79) v1(14.7,28.1) v1(14.7,26.83) v1(14.7,25.56) v1(14.7,24.29) v1(14.7,23.02) v1(14.7,21.75) v1(14.7,20.48) v1(14.7,19.21) v1(14.7,17.94) v1(15.97,28.1) v1(15.97,26.83) v1(15.97,25.56) v1(15.97,24.29) v1(15.97,23.02) v1(15.97,21.75) v1(15.97,20.48) v1(15.97,19.21) v1(15.97,17.94) v1(17.24,28.1) v1(17.24,26.83) v1(17.24,25.56) v1(17.24,24.29) v1(17.24,23.02) v1(17.24,21.75) v1(17.24,20.48) v1(17.24,19.21) v1(17.24,17.94) v1(18.51,31.91) v1(18.51,30.64) v1(18.51,29.37) v1(18.51,28.1) v1(18.51,26.83) v1(18.51,25.56) v1(18.51,24.29) v1(18.51,23.02) v1(18.51,21.75) v1(18.51,20.48) v1(18.51,19.21) v1(18.51,17.94)
232R: length 7
  Top Layer w0.254: R240.1 51.12,18.46 ; 51.12,18.46 50.15,19.43 H2.2 ; 51.12,18.46 52.79,18.46 53.1,18.16 111#2.1
232T: length 6.4
  Top Layer w0.254: 48.15,19.31 49.14,18.32 49.14,17.39 ; 48.15,19.31 47.16,18.31 111.1 ; 48.15,19.31 H2.1
ADC1_IN0: length 36.9
  Top Layer w0.178: CN2.30 v2(44.82,46.42)
  Inner2 w0.178: CN5.22 58.61,73.48 57.47,73.48 45.38,61.39 45.38,47.72 44.82,47.16 v2(44.82,46.42)
ADC1_IN1: length 44.4
  Top Layer w0.178: CN2.32 v2(45.53,46.92)
  Inner2 w0.178: v2(45.53,46.92) 46.04,47.43 46.04,61.37 57.23,72.56 65.69,72.56 CN5.20
ADC1_IN2: length 44.4
  Top Layer w0.178: CN2.34 v2(44.21,47.42)
  Inner2 w0.178: CN5.21 61.36,76.53 55.19,76.53 53.36,74.69 53.36,70.18 44.75,61.58 44.75,47.97 v2(44.21,47.42)
CAN1_RX: length 76.3
  Top Layer w0.178: CN2.51 v2(36.28,51.67)
  Top Layer w0.254: H5.5 93.78,33.95 v1(93.78,34.91)
  Inner1 w0.178: v1(93.78,34.91) 94.3,35.43 94.3,46.98 89.61,51.67 v2(36.28,51.67)
CAN1_TX: length 74.8
  Top Layer w0.178: CN2.49 v2(36.79,51.17)
  Top Layer w0.254: 94.96,32.58 94.96,32.6 v1(94.11,33.45)
  Inner1 w0.178: v1(94.11,33.45) 93.18,34.37 93.18,46.81 88.82,51.17 v2(36.79,51.17)
CAN2_RX: length 51.9
  Top Layer w0.178: CN2.74 v2(43.8,57.42)
  Top Layer w0.254: v1(92.42,56.31) 92.42,57.98 H4.5
  Inner1 w0.178: v1(92.42,56.31) 91.3,57.42 v2(43.8,57.42)
CAN2_TX: length 55.3
  Top Layer w0.178: CN2.72 v2(44.26,56.92)
  Top Layer w0.254: 94.96,57.98 94.96,55.55 v1(94.96,55.55)
  Inner1 w0.178: v2(44.26,56.92) 90.33,56.92 91.71,55.55 v1(94.96,55.55)
DATA_CANH: length 39.7
  Top Layer w0.254: 94.96,38.93 94.96,41.17 v1(94.96,41.17)
  Inner2 w0.254: v1(94.96,41.17) 93.89,42.23 93.89,43.17 92.69,44.37 82.41,44.37 81.75,45.03 81.75,64.62 CN5.1
DATA_CANL: length 39.7
  Top Layer w0.254: v1(92.42,41.17) 92.42,38.94 H4.2
  Inner2 w0.254: v1(92.42,41.17) 93.49,42.23 93.49,43 92.52,43.96 82.24,43.96 81.34,44.86 81.34,64.54 CN5.2
DEBUG_CLK: length 43.4
  Top Layer w0.203: CN2.36 42.66,47.92 v2(36.39,47.92)
  Top Layer w0.254: LINK1.2 v1(3.97,53.73)
  Inner2 w0.254: v2(36.39,47.92) 35.52,47.92 35.12,48.33 35.12,50.15 32.42,52.85 5.91,52.85 5.03,53.73 v1(3.97,53.73)
DEBUG_DIO: length 33.2
  Top Layer w0.203: v2(33.85,50.67) 35.11,50.67 CN2.47
  Top Layer w0.254: v1(3.97,52.5) 3.99,52.48 LINK1.3
  Inner2 w0.254: v2(33.85,50.67) 32.02,52.5 v1(3.97,52.5)
DEBUG_USART_RX: length 41
  Top Layer w0.203: CN2.53 35.1,52.15 v2(33.91,52.15)
  Top Layer w0.254: v1(4.08,62.71) 5.28,62.71 USART1.2
  Inner2 w0.254: v1(4.08,62.71) 4.66,62.12 4.66,55.97 6.19,54.44 32.91,54.44 33.91,53.45 v2(33.91,52.15)
DEBUG_USART_TX: length 39.4
  Top Layer w0.203: CN2.55 35.11,52.67 v2(33.38,52.67)
  Top Layer w0.254: USART1.3 5.28,61.49 v1(4.08,61.49)
  Inner2 w0.254: v2(33.38,52.67) 33.38,53.27 32.56,54.09 6.04,54.09 4.08,56.05 v1(4.08,61.49)
DOWNSHIFTSIGN_OUT: length 33.2
  Top Layer w0.254: 64.66,45.46 v1(64.66,44.47)
  Inner2 w0.254: CN5.11 73.72,70.16 73.72,49.38 68.81,44.47 v1(64.66,44.47)
DOWNSIGN_IN: length 46.9
  Top Layer w0.254: v1(74.38,57.98) 59.85,57.98 57.26,55.39 53.25,55.39 52.9,55.74 C158.1 R238.2 R198.2 52.48,54.63
  Inner1 w0.254: CN5.18 75.51,69.32 73.52,67.33 73.52,64.99 75.51,63.01 75.51,59.11 v1(74.38,57.98)
MCU_DOWMSHIFTSIGN_OUT: length 32.1
  Top Layer w0.178: R237.2 64.1,40.68 63.46,40.05 45.68,40.05 43.34,42.39 41.72,42.39 39.94,44.17 CN2.21
MCU_DOWNSIGN_IN: length 9.7
  Top Layer w0.254: R238.1 48.73,56.41 48.48,56.16 48.48,54.18 46.72,52.42 CN2.54
MCU_IOOUT1: length 51.7
  Top Layer w0.178: CN2.75 37.45,57.67
  Top Layer w0.254: v1(70.12,40.56) 70.12,41.78
  Inner2 w0.178: v1(70.12,40.56) 70.12,40.51 69.3,39.69 43.04,39.69 38.93,43.81 38.93,56.81 38.07,57.67 v2(37.46,57.67)
MCU_IOOUT2: length 53.8
  Top Layer w0.178: v2(38.01,56.67) 35.12,56.67 CN2.71
  Top Layer w0.254: v1(71.64,40.61) 71.64,41.78
  Inner2 w0.178: v1(71.64,40.61) 71.64,39.85 70.88,39.09 45.17,39.09 45.04,39.22 44.63,39.22 44.49,39.09 42.58,39.09 38.26,43.4 38.26,56.41 v2(38.01,56.67)
MCU_IOOUT3: length 37.6
  Top Layer w0.178: v2(71.64,55.9) 71.64,54.98 ; CN2.69 v2(36.28,56.17)
  Inner1 w0.178: v2(36.28,56.17) 71.37,56.17 v2(71.64,55.9)
MCU_IOOUT4: length 35.7
  Top Layer w0.178: CN2.67 v2(36.74,55.67) ; v2(70.12,55.67) 70.12,54.98
  Inner1 w0.178: v2(36.74,55.67) 70.11,55.67 v2(70.12,55.67)
MCU_SERVOPWM_1: length 24.6
  Top Layer w0.178: CN2.44 v2(44.26,49.92) ; v2(58.74,49.91) 58.74,53.72 59.25,54.22 62.34,54.22 62.57,54.45 R234.2
  Inner1 w0.178: v2(58.74,49.91) 58.72,49.92 v2(44.26,49.92)
MCU_SERVOPWM_2: length 26.8
  Top Layer w0.178: v2(58.13,50.42) 58.13,54.58 59.45,55.9 63.66,55.9 64.1,55.47 R235.2 ; CN2.46 v2(43.8,50.42)
  Inner1 w0.178: v2(43.8,50.42) v2(58.13,50.42)
MCU_UPSHIFTSIGN_IN: length 13
  Top Layer w0.254: R194.1 48.38,59.97 47.97,59.56 47.97,54.17 46.72,52.92 CN2.56
MCU_UPSHIFTSIGN_OUT: length 30
  Top Layer w0.178: CN2.23 40.3,44.67 41.97,43 43.7,43 46.04,40.66 62.14,40.66 62.57,41.09 R236.2
MOTO_CANH: length 85
  Top Layer w0.254: 94.96,13.53 94.96,11.93 v1(93.92,10.89)
  Inner2 w0.254: CN17.2 21.43,6.42 22.03,6.42 22.9,5.55 22.9,4.62 23.18,4.34 34.86,4.34 36.87,6.34 38.49,6.34 39.22,7.08 CN16.2 40.02,6.37 40.81,6.37 41.24,5.94 41.24,4.92 41.97,4.19 89.17,4.19 93.92,8.94 v1(93.92,10.89)
MOTO_CANL: length 86.4
  Top Layer w0.254: H5.2 92.41,13.28 v1(93.94,11.75)
  Inner2 w0.254: v1(93.94,11.75) 94.7,10.99 94.7,9.15 89.34,3.78 41.81,3.78 40.83,4.75 40.83,5.74 40.6,5.96 40.02,5.96 CN16.1 38.46,5.94 37.03,5.94 34.98,3.88 23.05,3.88 22.49,4.44 22.49,5.38 21.86,6.01 21.4,6.01 20.68,5.3 CN17.1
PB0: length 7.3
  Top Layer w0.254: CN2.52 46.72,51.92 47.69,52.89 49.51,52.89 R199.1
PC4: length 11.5
  Top Layer w0.178: CN2.48 47.66,50.92 48.22,50.36 48.22,46.15 48.68,45.69 49.49,45.69 R216.1
PC5: length 8.5
  Top Layer w0.254: R211.1 49.54,49.3 48.93,49.3 48.63,49.6 48.63,50.87 48.08,51.42 CN2.50
PD5: length 30.5
  Top Layer w0.178: CN2.31 v2(36.39,46.67)
  Top Layer w0.254: H2.5 52.15,29.95 v1(52.15,29.94)
  Inner2 w0.178: v1(52.15,29.94) 51.13,30.96 45.07,30.96 37.5,38.53 37.5,46.21 37.04,46.67 v2(36.39,46.67)
PD6: length 28.4
  Top Layer w0.178: CN2.29 v2(36.84,46.17)
  Top Layer w0.254: v1(50.15,29.94) H2.6
  Inner2 w0.178: v2(36.84,46.17) 36.84,38.37 44.82,30.4 49.69,30.4 v1(50.15,29.94)
PD8: length 29.2
  Top Layer w0.178: CN2.66 46.87,55.42 v2(47.26,55.04)
  Inner2 w0.178: CN5.6 60.04,62.91 49.14,62.91 47.26,61.03 v2(47.26,55.04)
PD9: length 25.8
  Top Layer w0.178: CN2.64 46.15,54.92 46.5,54.58 v2(46.6,54.58)
  Inner2 w0.178: CN5.7 56.8,63.67 48.98,63.67 46.6,61.28 v2(46.6,54.58)
POWERCTRL_MID: length 124.2
  Top Layer w0.254: v2(13.66,33.81) 13.66,34.63 ; v2(8.25,33.81) 8.25,34.63 ; SW1.2 40.96,26.53 v1(42.14,26.53)
  Inner2 w0.254: v2(8.25,33.81) v2(13.66,33.81) 14.28,33.19 36.74,33.19 37.66,32.28 v1(37.66,26.54) ; CN5.10 77.29,70.16 77.29,51.52 79.67,49.14 79.67,25.72 78.12,24.18 43.17,24.18 42.14,25.21 v1(42.14,26.53)
POWERCTRL_ON: length 96.1
  Top Layer w0.254: D2.2 43.19,28.07 R132.2 43.16,28.06 v1(41.01,28.06) 41.01,29.03 SW1.1
  Inner2 w0.254: v1(41.01,28.06) 41.01,25.37 42.56,23.82 78.27,23.82 80.02,25.57 80.02,49.29 77.64,51.67 77.64,67.64 78.65,68.65 79.78,68.65 CN5.9
SERVOPWM_1: length 16.8
  Top Layer w0.254: U56.11 63.36,52.29
  Inner2 w0.254: CN5.5 67.51,64.52 63.36,60.37 v1(63.36,52.29)
SERVOPWM_2: length 17.6
  Top Layer w0.254: U56.8 v1(65.31,52.29)
  Inner2 w0.254: CN5.4 65.31,60.18 v1(65.31,52.29)
SWITCH1_IN: length 52.4
  Top Layer w0.254: 52.48,51.08 R200.2 R199.2 C161.1 52.9,52.19 53.25,51.84 56.15,51.84 57.37,53.06 57.37,54.53 59.4,56.56 75.45,56.56 79.97,61.08 v1(79.97,61.23)
  Inner1 w0.254: CN5.17 79.51,69.37 81.5,67.38 81.5,65.5 79.97,63.98 v1(79.97,61.23)
SWITCH2_IN: length 37.2
  Top Layer w0.254: 52.48,47.52 R212.2 R211.2 C162.1 52.9,48.63 53.25,48.28 55.89,48.28 56.55,48.94 56.55,51.18 57.52,52.14
  Inner2 w0.254: CN5.14 61.51,69.42 62.77,68.16 64.24,68.16 65.29,67.12 65.29,65.64 57.52,57.87 v1(57.52,52.22)
SWITCH3_IN: length 40.6
  Top Layer w0.254: v1(59.35,44.72) 53.3,44.72 52.9,45.13 C163.1 R216.2 R217.2 52.48,43.97
  Inner2 w0.254: v1(59.35,44.72) 59.35,58.34 65.64,64.63 65.64,70.24 CN5.13
UPSHIFTSIGN_IN: length 40.5
  Top Layer w0.254: 52.48,58.19 R195.2 R194.2 C160.1 52.9,59.3 53.25,58.95 v1(70.73,58.95)
  Inner1 w0.254: CN5.19 71.51,69.13 69.46,67.08 69.46,64.74 70.73,63.47 v1(70.73,58.95)
UPSHIFTSIGN_OUT: length 36.5
  Top Layer w0.254: 62.71,45.46 v1(62.71,44.47)
  Inner2 w0.254: CN5.12 70.37,70.38 73.29,67.46 73.29,49.67 68.69,45.08 63.32,45.08 v1(62.71,44.47)
$3N17976: length 3.9
  Top Layer w0.254: 69.6,45.46 69.6,44.46 70.12,43.95 R228.1 R223.2
$3N17982: length 3.7
  Top Layer w0.254: 71.55,45.46 71.55,43.38 R229.1 R222.2
$3N18603: length 4.1
  Top Layer w0.254: 62.06,45.46 62.06,44.9 61.05,43.88 R231.2 R236.1
$3N18609: length 3.7
  Top Layer w0.254: 64.01,45.46 64.01,43.38 R237.1 R230.2
$3N20257: length 3.9
  Top Layer w0.254: U56.9 64.66,52.11 64.1,52.68 R235.1 R232.2
$3N20268: length 3.7
  Top Layer w0.254: U56.12 62.71,53.33 R234.1 R233.2
$3N20297: length 3.9
  Top Layer w0.254: R224.2 R227.1 71.64,52.65 72.2,52.09 U55.9
$3N20302: length 3.7
  Top Layer w0.254: R225.2 R226.1 70.25,53.33 U55.12
$5N12885: length 51.2
  Top Layer w0.254: 53.1,13.99 53.1,12.31 56.2,9.22 70.88,9.22 71.95,10.28 U54.3 ; 53.1,13.99 49.9,13.99 49.14,14.75 R241.2 ; 53.1,13.99 111#2.2
$5N12893: length 59.9
  Top Layer w0.254: U54.2 74.72,10.11 72.5,7.89 55.94,7.89 50.46,13.38 47.97,13.38 47.16,14.19 111.2 47.16,16.43 47.36,16.63 50.97,16.63 51.12,16.48 R240.2

## Copper pours and planes (outline as drawn; the poured copper is in the pictures)
GND_BAT on Top Layer: -1.16,66.92 6.21,66.92 6.52,67.23 6.52,57.53 7.02,57.02 7.02,52.09 6.62,51.68 6.62,45.59 -3.44,45.59 -3.59,45.74 -3.59,64.49
GND_BAT on Top Layer: 31.51,12.97 6.26,12.97 6.26,-1.39 3.11,-4.54 -4.92,3.48 -4.92,43.61 -0.6,47.92 5.75,47.92 6.72,46.96 6.72,16.31 18.28,16.31 19.47,17.5 19.77,17.5 19.77,39.49 10.17,49.09 6.87,49.09 6.57,49.4 6.57,59.05 6.87,59.36 15.36,59.36 15.36,64.03 2.05,64.03 -1.56,67.64 -1.56,73.43 0.78,75.76 35.19,75.76 36.19,74.76 36.19,65.81 30.14,65.81 29.22,64.89 29.22,58.56 30.11,57.67 32.74,57.67 33.49,56.92 33.49,51.68 32.73,50.92 30.09,50.92 29.22,50.06 29.22,43.25 31.51,40.97
GND_BAT on Bottom Layer: -1.82,77.14 33.44,77.14 36.13,74.44 36.13,63.17 31.41,58.44 31.41,13.03 -0.81,13.03 -1.82,14.04
GND_BAT on Inner1: -1.82,77.14 33.44,77.14 36.13,74.44 36.13,63.17 31.41,58.44 31.41,13.03 -0.81,13.03 -1.82,14.04
GND_BAT on Inner2: -1.82,77.14 33.44,77.14 36.13,74.44 36.13,63.17 31.41,58.44 31.41,13.03 -0.81,13.03 -1.82,14.04
GND_MOTO on Top Layer: 6.11,6.88 50.76,6.88 50.76,-0.84 6.11,-0.84
GND_MOTO on Bottom Layer: -2.32,6.88 50.76,6.88 50.76,-0.84 -2.32,-0.84
GND_MOTO on Inner1: -3.19,6.88 50.76,6.88 50.76,-0.84 -3.19,-0.84
GND_PRO on Top Layer: 36.5,59.22 34,56.71 33.46,56.71 33.46,42.51 31.71,40.76 31.71,13.38 31.66,13.33 50.1,13.33 50.86,12.57 50.86,-1.35 51.52,-2.01 100.8,-2.01 102.88,0.07 102.88,80.94 102.38,81.45 38.82,81.45 36.5,79.13
GND_PRO on Bottom Layer: 36.5,59.22 34,56.71 33.46,56.71 33.46,42.51 31.71,40.76 31.71,13.38 31.66,13.33 50.1,13.33 50.86,12.57 50.86,-1.35 51.52,-2.01 100.8,-2.01 102.88,0.07 102.88,80.94 102.38,81.45 38.82,81.45 36.5,79.13
GND_PRO on Inner1: 36.5,59.22 34,56.71 33.46,56.71 33.46,42.51 31.71,40.76 31.71,13.38 31.66,13.33 50.1,13.33 50.86,12.57 50.86,-1.35 51.52,-2.01 100.8,-2.01 102.88,0.07 102.88,80.94 102.38,81.45 38.82,81.45 36.5,79.13
GND_PRO on Inner2: 36.5,59.22 34,56.71 33.46,56.71 33.46,42.51 31.71,40.76 31.71,13.38 31.66,13.33 50.1,13.33 50.86,12.57 50.86,-1.35 51.52,-2.01 100.8,-2.01 102.88,0.07 102.88,80.94 102.38,81.45 38.82,81.45 36.5,79.13
VCC_+3V3 on Top Layer: 29.12,64.99 29.12,58.51 29.97,57.67 32.59,57.67 33.34,56.92 35.73,56.92 35.99,57.17 35.99,59.72 36.18,59.91 36.18,65.96 35.93,66.21 30.34,66.21
VCC_+3V3 on Inner2: 29.38,64.94 29.38,58.75 30.19,57.93 35.4,57.93 36.24,58.77 36.24,65.09 35.53,65.8 30.23,65.8
VCC_+5V on Top Layer: 38.88,39.49 38.88,38.05 40.28,36.65 44.97,36.65 44.97,40.25 44.11,41.12 43.75,41.12 43.75,39.14 43.55,38.93 41.01,38.93 40.91,39.04 40.91,39.72 40.7,39.92 39.61,39.92 39.48,39.8 39.18,39.8
VCC_+5V on Top Layer: 40.92,39.49 40.92,43.34 40.35,43.91 34.35,43.91 33.03,45.23 33.03,41.88 33.19,41.73 33.53,42.07 38.63,42.07 38.77,41.93 38.77,39.44 38.82,39.39 40.6,39.39 40.7,39.49
VCC_+5V on Top Layer: 30.04,50.97 29.12,50.06 29.12,43.16 31.37,40.92 32.58,40.92 33.34,41.68 33.34,50.36 32.73,50.97
VCC_+12V on Top Layer: 33.79,24.4 41.62,24.4 41.62,23.59 33.79,23.59
VCC_+12V on Top Layer: 6.62,44.32 6.62,33.5 7.02,33.1 19.58,33.1 19.93,33.45 19.93,43.56 19.16,44.32
VCC_+12V on Bottom Layer: 6.62,44.32 6.62,33.5 7.02,33.1 19.58,33.1 19.93,33.45 19.93,43.56 19.16,44.32
VCC_+12V on Inner1: 6.62,44.32 6.62,33.5 7.02,33.1 19.58,33.1 19.93,33.45 19.93,43.56 19.16,44.32
VCC_+12V on Inner2: 6.62,44.32 6.62,33.5 7.02,33.1 19.58,33.1 19.93,33.45 19.93,43.56 19.16,44.32
VCC_+24V on Top Layer: 6.16,13.08 6.16,6.83 6.11,6.78 26.99,6.78 27.04,6.73 27.04,3.56 34.57,3.56 34.66,3.47 34.66,6.74 45.63,6.74 45.63,3.61 50.73,3.61 50.76,3.58 50.76,12.57 50.25,13.08
VCC_+24V on Bottom Layer: -2.07,13.08 -2.07,6.78 26.99,6.78 27.04,6.73 27.04,3.56 34.57,3.56 34.66,3.47 34.66,6.74 45.63,6.74 45.63,3.61 50.73,3.61 50.76,3.58 50.76,12.57 50.25,13.08
VCC_+24V on Inner1: -3.09,13.08 -3.09,6.78 26.99,6.78 27.04,6.73 27.04,3.56 34.57,3.56 34.66,3.47 34.66,6.74 45.63,6.74 45.63,3.61 50.73,3.61 50.76,3.58 50.76,12.57 50.25,13.08
VCC_+24V on Inner2: -3.7,13.08 -3.7,-1.4 50.76,-1.4 50.76,12.57 50.25,13.08
VCC_BAT on Top Layer: 6.57,64.08 15.35,64.08 15.35,59.3 6.57,59.3
VCC_BAT on Top Layer: 6.57,49.19 15.35,49.19 15.35,44.42 6.57,44.42
VCC_BAT on Top Layer: 6.26,32.14 6.26,16.38 18.65,16.38 19.67,17.41 19.67,32.58 19.32,32.94 7.06,32.94
VCC_BAT on Bottom Layer: 6.7,49.19 15.49,49.19 15.49,44.42 6.7,44.42
VCC_BAT on Bottom Layer: 6.57,64.08 15.35,64.08 15.35,59.3 6.57,59.3
VCC_BAT on Bottom Layer: 18.81,64.08 19.67,63.22 19.67,31.36 19.42,31.11 14.14,31.11 13.73,31.52 13.73,64.08
VCC_BAT on Bottom Layer: 6.47,31.9 6.47,16.14 18.85,16.14 19.88,17.16 19.88,32.34 19.53,32.7 7.27,32.7
VCC_BAT on Inner1: 6.47,31.9 6.47,16.14 18.85,16.14 19.88,17.16 19.88,32.34 19.53,32.7 7.27,32.7
VCC_BAT on Inner2: 6.31,32.11 6.31,16.35 18.7,16.35 19.72,17.37 19.72,32.55 19.37,32.91 7.11,32.91
POWERCTRL_MID on Top Layer: 33.79,26.94 41.62,26.94 41.62,26.13 33.79,26.13
POWERCTRL_ON on Top Layer: 33.79,29.48 41.62,29.48 41.62,28.67 33.79,28.67

## Text on the board
Bottom Silkscreen Layer: JLCJLCJLC | 升压模块24vin1 | 电池12vin | 电池12out1 | 3V3 | CANH | PON | SW1 | CANL | PMID | DSIN | POFF | DSOU | UPIN | PWM2 | UPOU | PWM1 | ADC1 | SW3 | U3_TX | ADC2 | SW2 | U3_RX | ADC0 | GND | 16 | 1 | 9 | 15 | 8 | 23 | Designed By / SongJC Ver 3.0 | + | 。。。。。。。 | 。。。。。。。。 | 换得好挡 | 08
Top Silkscreen Layer: 222 | 3V3 / <- | 5V / -> | USART | MOTO_CANH | DATA_CANL | OFF | ON | Debug | 24V | 输入 | 升压 | 数传 | CyberMoto | XIAOMI_CyberMoto | RS232 / 转发器 | XIAOMI | DATA / CAN收发器 | MOTO / CAN收发器 | 08 | 换得上挡
